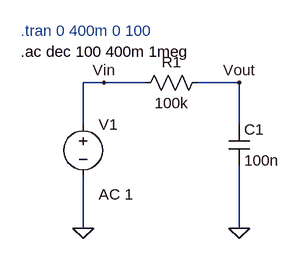
[diagram p0: schematic RCfilter.asc]
RCfilter.asc, the LTspice schematic file:
Version 4
SHEET 1 880 680
WIRE 32 80 0 80
WIRE 96 80 32 80
WIRE 240 80 176 80
WIRE 0 144 0 80
WIRE 240 144 240 80
WIRE 0 304 0 224
WIRE 240 304 240 208
FLAG 0 304 0
FLAG 240 304 0
FLAG 32 80 Vin
FLAG 240 80 Vout
SYMBOL voltage 0 128 R0
WINDOW 123 24 124 Left 2
WINDOW 39 0 0 Left 0
SYMATTR InstName V1
SYMATTR Value ""
SYMATTR Value2 AC 1
SYMBOL res 192 64 R90
WINDOW 0 0 56 VBottom 2
WINDOW 3 32 56 VTop 2
SYMATTR InstName R1
SYMATTR Value 100k
SYMBOL cap 224 144 R0
SYMATTR InstName C1
SYMATTR Value 100n
TEXT -96 0 Left 2 ;.tran 0 400m 0 100
TEXT -96 32 Left 2 !.ac dec 100 400m 1meg

The netlist it stands for:
* RCfilter.asc
V1 Vin 0 AC 1
R1 Vout Vin 100k
C1 Vout 0 100n
* .tran 0 400m 0 100
.ac dec 100 400m 1meg
.backanno
.end

* Results of the author's LTspice run, read from the files saved beside the schematic
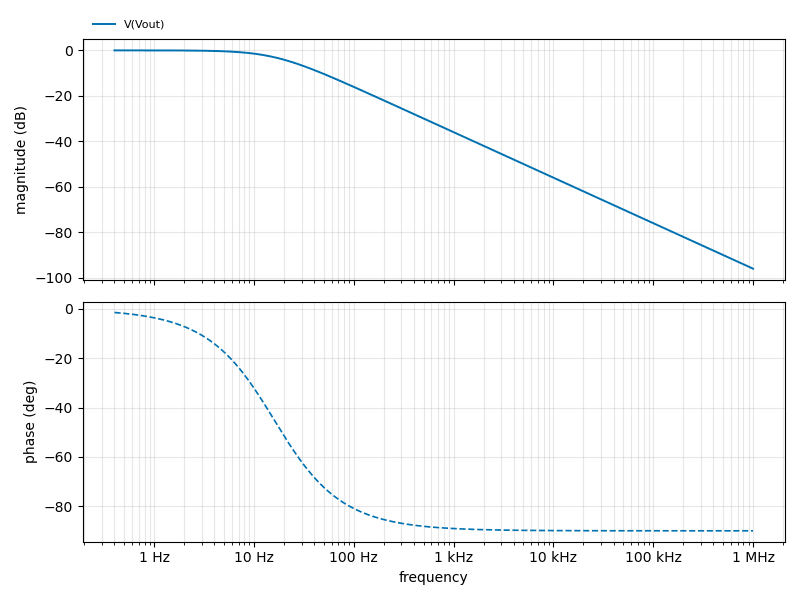
[diagram p1: AC Analysis of RCfilter.asc, plotted from the saved traces]
* AC Analysis, 1 run:
*   V(Vout): -0.00 dB at 400 mHz, -95.96 dB at 1 MHz, peak -0.00 dB at 400 mHz, 3 dB below the peak at 15.93 Hz